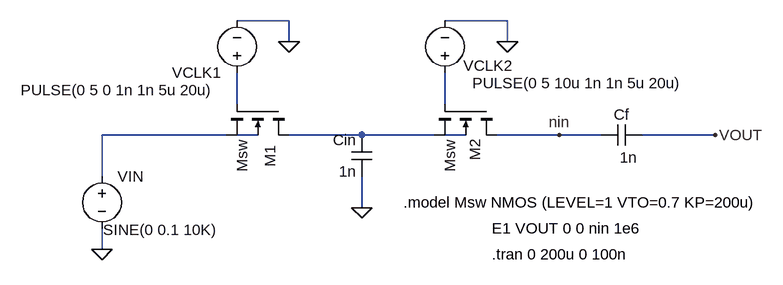
[diagram p0: schematic switching_capacitor_integrator.asc]
switching_capacitor_integrator.asc, the LTspice schematic file:
Version 4.1
SHEET 1 1024 680
WIRE -192 -48 -272 -48
WIRE 144 -48 48 -48
WIRE -192 -16 -192 -48
WIRE 144 -16 144 -48
WIRE -272 80 -272 32
WIRE 48 80 48 32
WIRE -288 128 -480 128
WIRE -240 128 -272 128
WIRE -80 128 -192 128
WIRE 32 128 -80 128
WIRE 80 128 48 128
WIRE 224 128 128 128
WIRE 288 128 224 128
WIRE 464 128 352 128
WIRE -480 192 -480 128
WIRE -80 240 -80 192
WIRE -480 304 -480 272
FLAG -480 304 0
FLAG 464 128 VOUT
FLAG 224 128 nin
FLAG -192 -16 0
FLAG 144 -16 0
FLAG -80 240 0
SYMBOL cap -64 192 R180
WINDOW 0 24 56 Left 2
WINDOW 3 24 8 Left 2
SYMATTR InstName Cin
SYMATTR Value 1n
SYMBOL voltage -480 176 R0
WINDOW 3 2 98 Left 2
WINDOW 123 0 0 Left 0
WINDOW 39 0 0 Left 0
SYMATTR Value SINE(0 0.1 10K)
SYMATTR InstName VIN
SYMBOL nmos4 -192 80 R90
WINDOW 0 64 29 Left 2
SYMATTR InstName M1
SYMATTR Value Msw
SYMBOL nmos4 128 80 R90
WINDOW 0 54 34 Left 2
SYMATTR InstName M2
SYMATTR Value Msw
SYMBOL voltage -272 48 R180
WINDOW 123 0 0 Left 0
WINDOW 39 0 0 Left 0
WINDOW 3 36 -11 Left 2
SYMATTR Value PULSE(0 5 0 1n 1n 5u 20u)
SYMATTR InstName VCLK1
SYMBOL voltage 48 48 R180
WINDOW 123 0 0 Left 0
WINDOW 39 0 0 Left 0
WINDOW 0 -104 27 Left 2
WINDOW 3 -366 0 Left 2
SYMATTR InstName VCLK2
SYMATTR Value PULSE(0 5 10u 1n 1n 5u 20u)
SYMBOL cap 352 112 R90
WINDOW 0 0 32 VBottom 2
WINDOW 3 35 21 VTop 2
SYMATTR InstName Cf
SYMATTR Value 1n
TEXT -16 232 Left 2 !.model Msw NMOS (LEVEL=1 VTO=0.7 KP=200u)
TEXT 120 312 Left 2 !.tran 0 200u 0 100n
TEXT 120 272 Left 2 !E1 VOUT 0 0 nin 1e6

The netlist it stands for:
* switching_capacitor_integrator.asc
Cin 0 N005 1n
VIN N003 0 SINE(0 0.1 10K)
M1 N005 N001 N003 N004 Msw
M2 nin N002 N005 N006 Msw
VCLK1 N001 0 PULSE(0 5 0 1n 1n 5u 20u)
VCLK2 N002 0 PULSE(0 5 10u 1n 1n 5u 20u)
Cf VOUT nin 1n
.model NMOS NMOS
.model PMOS PMOS
.lib standard.mos
.model Msw NMOS (LEVEL=1 VTO=0.7 KP=200u)
.tran 0 200u 0 100n
E1 VOUT 0 0 nin 1e6
.backanno
.end

* Results of the author's LTspice run, read from the files saved beside the schematic
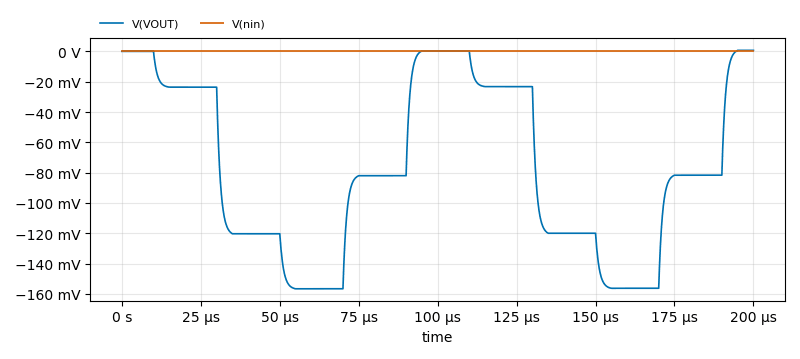
[diagram p1: Transient Analysis of switching_capacitor_integrator.asc, plotted from the saved traces]
* Transient Analysis, 1 run:
*   V(VOUT): min -156.6 mV, max 665.4 µV, average -76.3 mV, rms 95.43 mV, last 665.4 µV
*   V(nin): min -665.4 pV, max 156.6 nV, average 76.3 nV, rms 95.43 nV, last -665.4 pV